# EAGLE design Meishino_v12 (EAGLE 9.0.1)
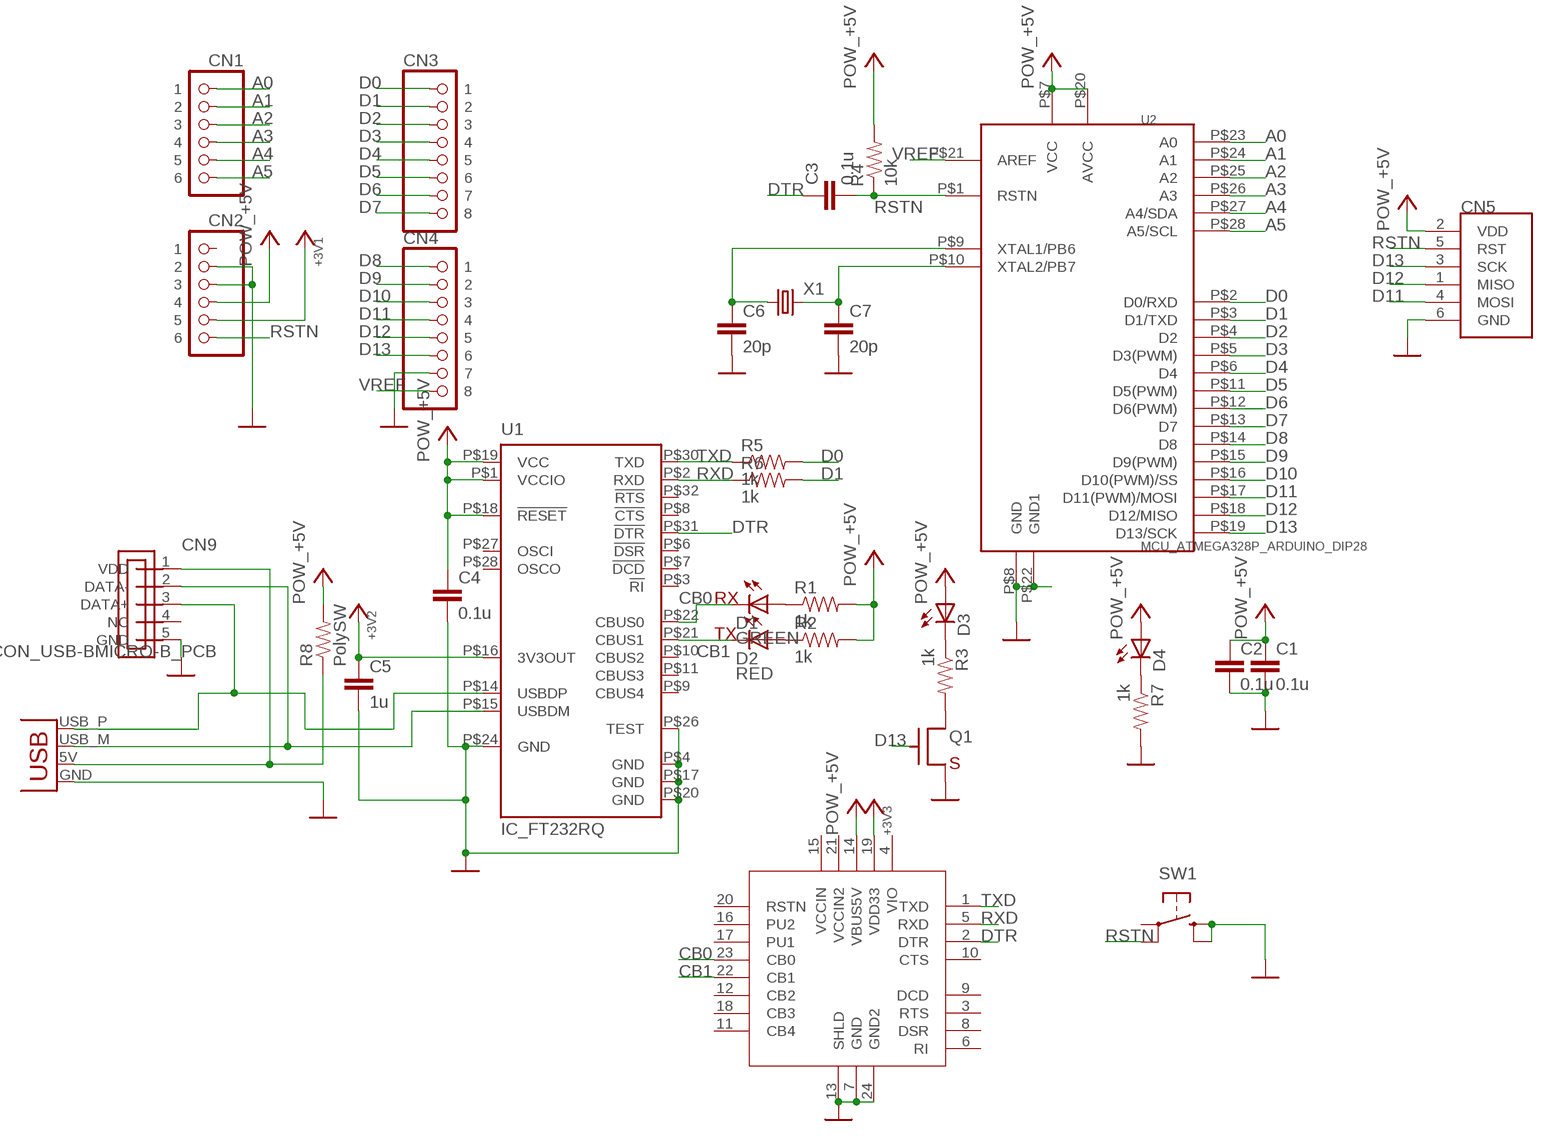
[diagram p0: schematic, sheet 1]

## Parts
C1  0.1u  CAPTH_5MML  [CAP_TH_5MM_L]
C2  0.1u  CAPTH_5MML  [CAP_TH_5MM_L]
C3  0.1u  CAPTH_5MML  [CAP_TH_5MM_L]
C4  0.1u  CAPTH_5MML  [CAP_TH_5MM_L]
C5  1u  CAPTH_5MML  [CAP_TH_5MM_L]
C6  20p  CAPTH_5MML  [CAP_TH_5MM_L]
C7  20p  CAPTH_5MML  [CAP_TH_5MM_L]
CN1  CON_PINHD-1X6  [1X06]
CN2  CON_PINHD-1X6  [1X06]
CN3  CON_PINHD-1X8  [1X08]
CN4  CON_PINHD-1X8  [1X08]
CN5  CON_AVRISPTH  [2X03R]
CN9  CON_USB-BMICRO-B_PCB  [USB-MICRO-PCB]
D1  GREEN  LED5MM  [SPARKFUN_LED5MM]
D2  RED  LED5MM  [SPARKFUN_LED5MM]
D3  LED5MM  [SPARKFUN_LED5MM]
D4  LED5MM  [SPARKFUN_LED5MM]
JP2  CON_USBPCB  [USB-A-PCB]
Q1  TR_NMOS_2N7000  [TO-92]
R1  1k  RESTH_10MML  [R_TH_10MM_L]
R2  1k  RESTH_10MML  [R_TH_10MM_L]
R3  1k  RESTH_10MML  [R_TH_10MM_L]
R4  10k  RESTH_10MML  [R_TH_10MM_L]
R5  1k  RESTH_10MML  [R_TH_10MM_L]
R6  1k  RESTH_10MML  [R_TH_10MM_L]
R7  1k  RESTH_10MML  [R_TH_10MM_L]
R8  PolySW  RESTH_10MML  [R_TH_10MM_L]
SW1  SW_TACTTH  [SW_B3F-10XX]
U1  IC_FT232RQ  [QFN32]
U2  MCU_ATMEGA328P_ARDUINO_DIP28  [DIP-28P(300MIL)]
U3  MOD_AE_FT232_DIP24  [DIP24_600MIL]
X1  XTAL2HC49US  [HC49US]

## Nets
+3V3: C5.1 CN2.5 U1.P$16(3V3OUT) U3.19(VDD33) ; supply symbol labelled POW_+3V3
+5V: C1.1 C2.1 C4.1 CN2.4 CN5.2(VDD) D3.A D4.A R1.2 R2.2 R4.2 R8.2 U1.P$1(VCCIO) U1.P$18(!RESET) U1.P$19(VCC) U2.P$7(VCC) U2.P$20(AVCC) U3.14(VBUS5V) ; supply symbol labelled POW_+5V
A0: CN1.1 U2.P$23(A0)
A1: CN1.2 U2.P$24(A1)
A2: CN1.3 U2.P$25(A2)
A3: CN1.4 U2.P$26(A3)
A4: CN1.5 U2.P$27(A4/SDA)
A5: CN1.6 U2.P$28(A5/SCL)
CB0: D1.K(C) U1.P$22(CBUS0) U3.23(CB0)
CB1: D2.K(C) U1.P$21(CBUS1) U3.22(CB1)
D0: CN3.1 R5.2 U2.P$2(D0/RXD)
D1: CN3.2 R6.2 U2.P$3(D1/TXD)
D2: CN3.3 U2.P$4(D2)
D3: CN3.4 U2.P$5(D3(PWM))
D4: CN3.5 U2.P$6(D4)
D5: CN3.6 U2.P$11(D5(PWM))
D6: CN3.7 U2.P$12(D6(PWM))
D7: CN3.8 U2.P$13(D7)
D8: CN4.1 U2.P$14(D8)
D9: CN4.2 U2.P$15(D9(PWM))
D10: CN4.3 U2.P$16(D10(PWM)/SS)
D11: CN4.4 CN5.4(MOSI) U2.P$17(D11(PWM)/MOSI)
D12: CN4.5 CN5.1(MISO) U2.P$18(D12/MISO)
D13: CN4.6 CN5.3(SCK) Q1.2(G) U2.P$19(D13/SCK)
DTR: C3.1 U1.P$31(!DTR) U3.2(DTR)
GND: C1.2 C2.2 C4.2 C5.2 C6.2 C7.2 CN2.2 CN2.3 CN4.7 CN5.6(GND) CN9.5(GND) JP2.GND Q1.1(S) R7.2 SW1.1(S) SW1.2(S1) U1.P$4(GND) U1.P$17(GND) U1.P$20(GND) U1.P$24(GND) U1.P$26(TEST) U2.P$8(GND) U2.P$22(GND1) U3.7(GND) U3.13(SHLD) U3.24(GND2) ; supply symbol labelled POW_GND
N$1: D1.A R1.1
N$2: D2.A R2.1
N$7: D3.K(C) R3.1
N$9: CN9.3(DATA+) JP2.USB_P(D+) U1.P$14(USBDP)
N$12: CN9.2(DATA-) JP2.USB_M(D-) U1.P$15(USBDM)
N$14: D4.K(C) R7.1
N$15: C6.1 U2.P$9(XTAL1/PB6) X1.1
N$16: C7.1 U2.P$10(XTAL2/PB7) X1.2
N$18: CN9.1(VDD) JP2.5V(VBUS) R8.1
N$19: Q1.3(D) R3.2
RSTN: C3.2 CN2.6 CN5.5(RST) R4.1 SW1.4(P1) U2.P$1(RSTN)
RXD: R6.1 U1.P$2(RXD) U3.5(RXD)
TXD: R5.1 U1.P$30(TXD) U3.1(TXD)
VREF: CN4.8 U2.P$21(AREF)
Unconnected: CN2.1 CN9.4(NC) SW1.3(P) U1.P$3(!RI) U1.P$6(!DSR) U1.P$7(!DCD) U1.P$8(!CTS) U1.P$9(CBUS4) U1.P$10(CBUS2) U1.P$11(CBUS3) U1.P$27(OSCI) U1.P$28(OSCO) U1.P$32(!RTS) U3.3(RTS) U3.4(VIO) U3.6(RI) U3.8(DSR) U3.9(DCD) U3.10(CTS) U3.11(CB4) U3.12(CB2) U3.15(VCCIN) U3.16(PU2) U3.17(PU1) U3.18(CB3) U3.20(RSTN) U3.21(VCCIN2)

## Notes on the sheet
- RX
- TX

## Library data of the parts
C1-C7 = akita:CAP: Capacitor Standard 0603 ceramic capacitor, and 0.1" leaded capacitor.
CN1 CN2 = akita:CON_PINHD-1X6: PIN HEADER
CN3 CN4 = akita:CON_PINHD-1X8: PIN HEADER
CN5 = akita:CON_AVRISP: AVR ISP standard 2x3 connector
CN9 = akita:CON_USB-B
D1-D4 = akita:LED: LEDs Standard schematic elements and footprints for 5mm, 3mm, 1206, and 0603 sized LEDs. 5mm - Spark Fun Electronics SKU : COM-00529 (and others)
JP2 = akita:CON_USB: USB Connectors USB-B-PTH is fully proven SKU : PRT-00139/CONN-08278 USB-miniB is fully proven SKU : PRT-00587 USB-A-PCB is untested. USB-A-H is throughly reviewed, but untested. Spark Fun Electronics SKU : PRT-00437 USB-B-SMT is throughly reviewed, but untested. Needs silkscreen touching up. USB-A-S has not been used/tested USB-MB-H has not been used/tested USB-MICROB has been used. CONN-09505
Q1 = akita:TR_NMOS_2N7000: 2N7000, nMOS
R1-R8 = akita:RES: Resistor Basic schematic elements and footprints for 0603, 1206, and PTH resistors.
SW1 = akita:SW_TACT: OMRON SWITCH; MPN: B3F-1000; OC_FARNELL: 176432; OC_NEWARK: 36M3542
U1 = akita:IC_FT232R: Source: http://www.ftdichip.com/Documents/DataSheets/DS_FT232R_v104.pdf
U2 = akita:MCU_ATMEGA328P_ARDUINO_DIP28: ATmega328P, Arduino's pin assign, DIP28
U3 = akita:MOD_AE_FT232_DIP24: Akizuki's FT232, DIP24
X1 = akita:XTAL2: Crystals Various standard crystals. Proven footprints. Spark Fun Electronics SKU : COM-00534

## Board
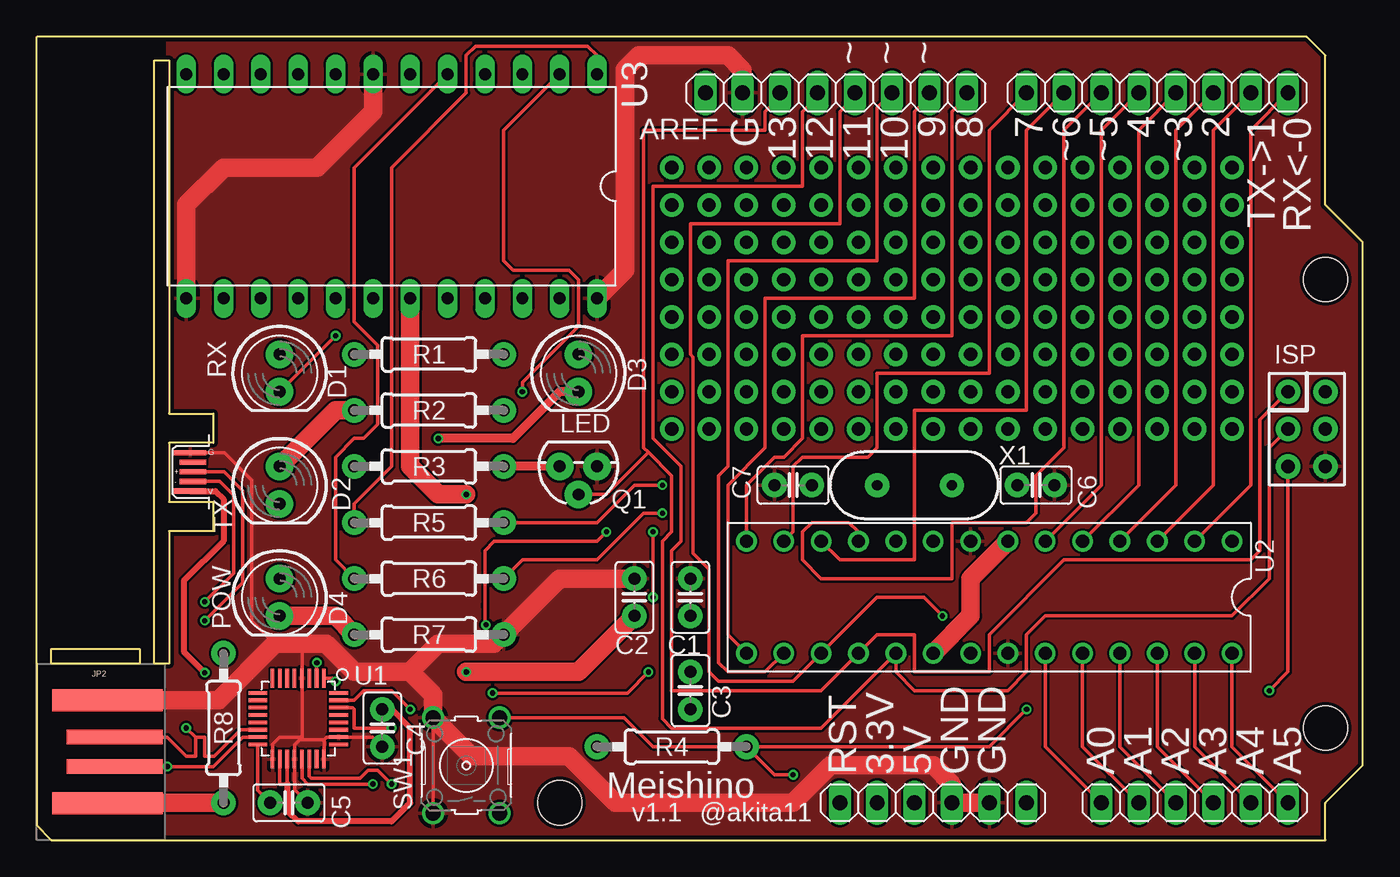
[diagram p1: board, top side]
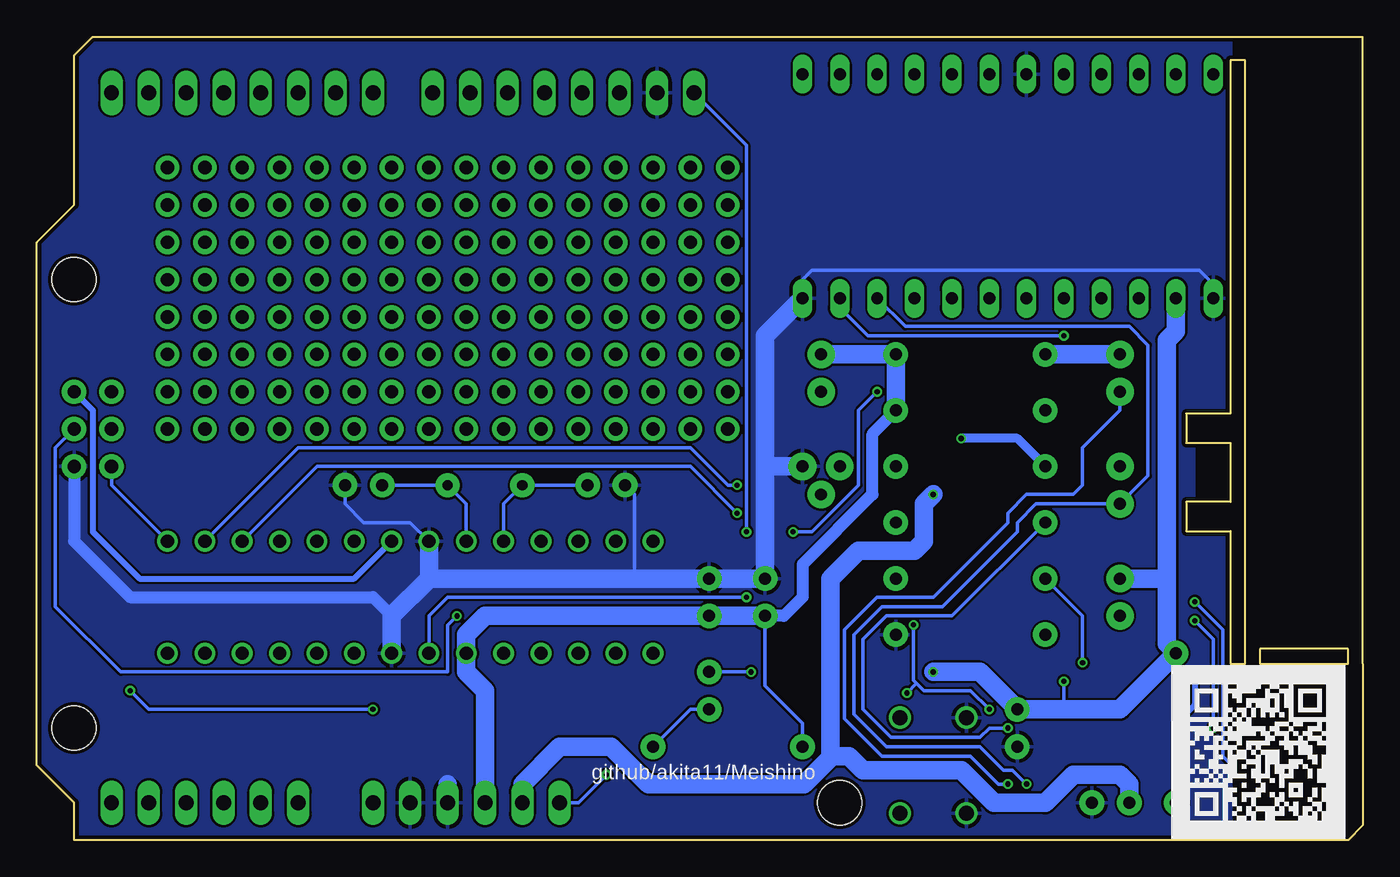
[diagram p2: board, bottom side, seen from below]

Size 90.17 x 54.61 mm. Coordinates in mm from the lower left corner, seen from the top.
Outline: 1,0 87.63,0 87.63,2.54 90.17,5.08 90.17,40.64 87.63,43.18 87.63,53.34 86.36,54.61 0,54.61 0,12 0,1 1,0
Outline: 9,29 12,29 12,27 9,27 9,23 12,23 12,21 9,21 9,12 8,12 8,53 9,53 9,29
Outline: 7,12 1,12 1,13 7,13 7,12
Copper layers (1*16): Top 0.035mm / dielectric 1.5mm / Bottom 0.035mm
Design rules "SeeedStudio_2layer_DRU_no_angle_20140221": minimum track width 6mil, minimum drill 12mil, track to track 6mil, track to pad 6mil, pad to pad 6mil, via to via 6mil, smd to smd 0mil, copper to edge 10mil, drill to drill 10mil, minimum pad ring 10mil, minimum via ring 6mil, stop-mask expansion 2mil, vias tented up to drill 100mil, thermal gap 10mil
Holes 3 mm at 87.63,7.62 87.63,38.1 35.56,2.54

### Footprints (pad centres in the part's own frame; a part is rotated, then mirrored left to right if it is on the bottom)
CAP_TH_5MM_L = drill 0.813 pad 1.676: 1 -1.27,0; 2 1.27,0
1X06 = drill 1.016 long: 1 -6.35,0; 2 -3.81,0; 3 -1.27,0; 4 1.27,0; 5 3.81,0; 6 6.35,0
1X08 = drill 1.016 long: 1 -8.89,0; 2 -6.35,0; 3 -3.81,0; 4 -1.27,0; 5 1.27,0; 6 3.81,0; 7 6.35,0; 8 8.89,0
2X03R = drill 0.9 pad 1.651: 1 -2.54,-1.27; 2 -2.54,1.27; 3 0,-1.27; 4 0,1.27; 5 2.54,-1.27; 6 2.54,1.27
USB-MICRO-PCB = smd 0.35 x 2.2: 1 1.3,-1.3; 5 -1.3,-1.3 | smd 0.35 x 1.8: 2 0.65,-1.1; 3 0,-1.1; 4 -0.65,-1.1
SPARKFUN_LED5MM = drill 0.813 pad 1.88: A -1.27,0; K 1.27,0
USB-A-PCB = smd 7.5 x 1.5: 5V -0.2,-3.5; GND -0.2,3.5 | smd 6.5 x 1: USB_M 0.3,-1; USB_P 0.3,1
TO-92 = drill 0.813 pad 1.88: 1 -1.27,0; 2 0,1.905; 3 1.27,0
R_TH_10MM_L = drill 0.813 pad 1.676: 1 -5.08,0; 2 5.08,0
SW_B3F-10XX = drill 1.016: 1 -3.251,2.261; 2 3.251,2.261; 3 -3.251,-2.261; 4 3.251,-2.261
QFN32 = smd 1.27 x 0.25: P$1 -2.75,1.75; P$2 -2.75,1.25; P$3 -2.75,0.75; P$4 -2.75,0.25; P$5 -2.75,-0.25; P$6 -2.75,-0.75; P$7 -2.75,-1.25; P$8 -2.75,-1.75; P$17 2.75,-1.75; P$18 2.75,-1.25; P$19 2.75,-0.75; P$20 2.75,-0.25; P$21 2.75,0.25; P$22 2.75,0.75; P$23 2.75,1.25; P$24 2.75,1.75 | smd 0.25 x 1.27: P$9 -1.75,-2.75; P$10 -1.25,-2.75; P$11 -0.75,-2.75; P$12 -0.25,-2.75; P$13 0.25,-2.75; P$14 0.75,-2.75; P$15 1.25,-2.75; P$16 1.75,-2.75; P$25 1.75,2.75; P$26 1.25,2.75; P$27 0.75,2.75; P$28 0.25,2.75; P$29 -0.25,2.75; P$30 -0.75,2.75; P$31 -1.25,2.75; P$32 -1.75,2.75
DIP-28P(300MIL) = drill 0.9: P$1 -17.78,-3.81; P$2 -15.24,-3.81; P$3 -12.7,-3.81; P$4 -10.16,-3.81; P$5 -7.62,-3.81; P$6 -5.08,-3.81; P$7 -2.54,-3.81; P$8 0,-3.81; P$9 2.54,-3.81; P$10 5.08,-3.81; P$11 7.62,-3.81; P$12 10.16,-3.81; P$13 12.7,-3.81; P$14 15.24,-3.81; P$15 15.24,3.81; P$16 12.7,3.81; P$17 10.16,3.81; P$18 7.62,3.81; P$19 5.08,3.81; P$20 2.54,3.81; P$21 0,3.81; P$22 -2.54,3.81; P$23 -5.08,3.81; P$24 -7.62,3.81; P$25 -10.16,3.81; P$26 -12.7,3.81; P$27 -15.24,3.81; P$28 -17.78,3.81
DIP24_600MIL = drill 0.813 long: 1 -13.97,-7.62; 2 -11.43,-7.62; 3 -8.89,-7.62; 4 -6.35,-7.62; 5 -3.81,-7.62; 6 -1.27,-7.62; 7 1.27,-7.62; 8 3.81,-7.62; 9 6.35,-7.62; 10 8.89,-7.62; 11 11.43,-7.62; 12 13.97,-7.62; 13 13.97,7.62; 14 11.43,7.62; 15 8.89,7.62; 16 6.35,7.62; 17 3.81,7.62; 18 1.27,7.62; 19 -1.27,7.62; 20 -3.81,7.62; 21 -6.35,7.62; 22 -8.89,7.62; 23 -11.43,7.62; 24 -13.97,7.62
HC49US = drill 0.7 pad 1.651: 1 -2.54,0; 2 2.54,0

### Placement (x,y rotation side)
C1  44.45,16.51 90 top
C2  40.64,16.51 90 top
C3  44.45,10.16 270 top
C4  23.5,7.62 270 top
C5  17.14,2.54 0 top
C6  67.94,24.13 0 top
C7  51.44,24.13 180 top
CN1  78.74,2.54 0 top
CN2  60.96,2.54 180 top
CN3  76.2,50.8 180 top
CN4  54.36,50.8 180 top
CN5  86.36,27.94 270 top
CN9  11.72,25.03 270 top
D1  16.51,31.75 270 top
D2  16.51,24.13 270 top
D3  36.83,31.75 270 top
D4  16.51,16.51 270 top
JP2  5,6 0 top
Q1  36.83,25.4 180 top
R1  26.67,33.02 0 top
R2  26.67,29.21 0 top
R3  26.67,25.4 0 top
R4  43.18,6.35 180 top
R5  26.67,21.59 0 top
R6  26.67,17.78 0 top
R7  26.67,13.97 0 top
R8  12.7,7.62 90 top
SW1  29.21,5.08 90 top
U1  17.78,8.26 270 top
U2  63.5,16.51 180 top
U3  24.13,44.45 180 top
X1  59.69,24.13 180 top

### Tracks (layer width: path | path; a pad name or v marks a point on that pad's centre or on a via)
+3V3  (via drill 0.35)
  Top 0.254: U1.P$16 15.03,3.38 C5.1
  Top 1.27: U3.19 25.4,25.4 27.3,23.5 v29.21,23.5
  Bottom 1.27: C5.1 15.88,3.81 16.51,4.45 19.68,4.45 21.59,2.54 25.08,2.54 27.3,4.76 33.97,4.76 34.92,5.71 36.2,5.71 | CN2.5 57.15,3.81 54.61,6.35 51.12,6.35 48.58,3.81 37.99,3.81 36.2,5.6 36.2,5.71 | v29.21,23.5 29.84,22.86 29.84,20.32 30.48,19.68 34.29,19.68 36.2,17.78 36.2,5.71
+5V  (via drill 0.35)
  Top 0.254: U1.P$19 17.03,3.81 16.53,3.81 U1.P$18 | 23.5,9.53 C4.1 | U1.P$1 20.11,11.01 v20.32,10.79
  Top 0.406: C4.1 24.13,8.89 25.4,7.62 25.4,2.54 24.13,1.27 17.78,1.27 17.14,1.91 17.14,3.13 17.05,3.23 17.05,3.79 17.03,3.81
  Top 1.27: U2.P$7 63.5,17.78 63.5,15.24 U2.P$20 | C2.1 36.83,11.43 v29.21,11.43
  Bottom 0.254: v20.32,10.79 20.32,8.89 | R4.2 38.1,7.94 40.64,10.48 C2.1
  Bottom 0.406: 87.63,30.25 CN5.2 86.36,29.21 86.36,20.95 83.19,17.78 68.58,17.78 U2.P$7
  Bottom 0.813: C2.1 39.37,15.24 38.1,16.51 38.1,18.73 33.34,23.5 33.34,27.62 R2.2
  Bottom 1.27: CN2.4 59.69,10.16 60.96,11.43 U2.P$20 60.96,13.97 59.69,15.24 C1.1 C2.1 | v29.21,11.43 26.04,11.43 C4.1 20.32,8.89 16.51,8.89 R8.2 13.34,13.34 13.34,17.78 | D3.A R1.2 R2.2 | U3.14 12.7,34.61 13.34,33.97 13.34,17.78 | D4.A 13.34,17.78
A0
  Top 0.254: U2.P$23 68.58,6.35 CN1.1
A1
  Top 0.254: U2.P$24 71.12,6.35 CN1.2
A2
  Top 0.254: U2.P$25 73.66,6.35 CN1.3
A3
  Top 0.254: U2.P$26 76.2,6.35 CN1.4
A4
  Top 0.254: U2.P$27 78.74,6.35 CN1.5
A5
  Top 0.254: U2.P$28 81.28,6.35 CN1.6
CB0  (via drill 0.35)
  Top 0.254: U1.P$22 18.53,4.33 18.64,4.22 22,4.22 22.54,4.76 23.18,4.76 v24.13,3.81 | D1.K v20.32,34.29
  Bottom 0.254: D1.K 16.51,29.21 19.05,26.67 19.05,24.13 19.68,23.5 22.86,23.5 24.13,22.23 24.13,21.59 29.21,16.51 33.02,16.51 35.24,14.29 35.24,8.26 32.7,5.71 26.67,5.71 24.77,3.81 v24.13,3.81 | v20.32,34.29 33.66,34.29 35.56,36.2 U3.23
CB1  (via drill 0.35)
  Top 0.254: U1.P$21 18.03,4.2 18.41,3.81 v22.86,3.81
  Bottom 0.254: v22.86,3.81 23.81,4.76 24.45,4.76 26.04,6.35 32.38,6.35 34.61,8.57 34.61,13.97 32.7,15.88 28.57,15.88 23.5,20.95 23.5,21.59 22.23,22.86 D2.K 14.61,24.77 14.61,33.66 15.88,34.92 31.11,34.92 U3.22
D0  (via drill 0.35)
  Top 0.254: U2.P$2 82.55,24.13 82.55,48.26 CN3.1 | v42.55,24.13 40.64,24.13 38.1,21.59 R5.2
  Bottom 0.254: U2.P$2 72.39,26.67 45.72,26.67 43.18,24.13 v42.55,24.13
D1  (via drill 0.35)
  Top 0.254: U2.P$3 80.01,24.13 80.01,48.26 CN3.2 | R6.2 33.02,19.05 38.1,19.05 39.37,20.32 40.03,20.98 41.27,22.23 v42.55,22.23
  Bottom 0.254: U2.P$3 71.12,25.4 45.72,25.4 v42.55,22.23
D2
  Top 0.254: U2.P$4 77.47,24.13 77.47,48.26 CN3.3
D3
  Top 0.254: U2.P$5 74.93,24.13 74.93,48.26 CN3.4
D4
  Top 0.254: U2.P$6 72.39,24.13 72.39,48.26 CN3.5
D5
  Top 0.254: CN3.6 69.85,48.26 69.85,26.67 67.94,24.77 67.94,22.23 67.31,21.59 62.23,21.59 62.23,17.78 53.34,17.78 52.07,19.05 52.07,20.95 52.7,21.59 55.24,21.59 55.88,20.95 U2.P$11
D6
  Top 0.254: CN3.7 67.31,48.26 67.31,29.21 59.69,29.21 59.69,19.05 54.61,19.05 U2.P$12
D7
  Top 0.254: CN3.8 64.77,48.26 64.77,31.75 57.15,31.75 57.15,26.67 56.52,26.04 52.07,26.04 51.44,25.4 51.44,20.95 U2.P$13
D8
  Top 0.254: CN4.1 63.25,50.55 62.23,49.53 62.23,34.29 52.07,34.29 52.07,27.3 50.8,26.04 50.16,26.04 48.26,24.13 U2.P$14
D9
  Top 0.254: CN4.2 60.71,50.55 59.69,49.53 59.69,36.83 49.53,36.83 49.53,26.67 46.99,24.13 46.99,13.97 U2.P$15
D10
  Top 0.254: CN4.3 57.15,49.78 57.15,39.37 46.99,39.37 46.99,25.4 46.35,24.77 46.35,12.06 46.99,11.43 49.53,11.43 U2.P$16
D11  (via drill 0.35)
  Top 0.254: CN4.4 55.63,50.55 54.61,49.53 54.61,41.91 44.45,41.91 44.45,33.02 44.64,32.83 44.64,19.49 45.72,18.41 45.72,11.43 46.35,10.79 51.44,10.79 U2.P$17 57.15,16.51 60.33,16.51 v61.59,15.24
  Bottom 0.254: v61.59,15.24 62.23,14.61 62.23,11.43 84.45,11.43 88.9,15.88 88.9,26.67 CN5.4
D12
  Top 0.254: CN4.5 53.09,50.55 52.07,49.53 52.07,44.45 41.91,44.45 41.91,27.3 43.81,25.4 43.81,20.32 43.18,19.68 43.18,10.16 53.34,10.16 U2.P$18 57.15,13.97 59.69,13.97 59.69,11.43 64.77,11.43 64.77,13.97 69.85,19.05 82.55,19.05 83.19,19.68 83.19,28.57 CN5.1
D13
  Top 0.254: CN4.6 50.55,50.55 49.53,49.53 49.53,48.26 41.27,48.26 41.27,26.67 41.59,26.35 | 41.59,26.35 43.18,24.77 43.18,20.95 42.55,20.32 42.55,8.26 43.18,7.62 53.34,7.62 U2.P$19 58.42,11.43 59.69,10.16 66.04,10.16 67.31,11.43 67.31,13.97 68.58,15.24 81.28,15.24 83.82,17.78 83.82,26.67 CN5.3 | Q1.2 38.73,23.5 41.59,26.35
DTR  (via drill 0.35)
  Top 0.254: U1.P$31 21.57,9.51 22.23,10.16 24.13,10.16 v25.4,8.89 | 30.48,16 30.48,19.68 31.11,20.32 38.1,20.32 v38.73,20.95 | 30.48,16 30.48,15.88 | 30.48,16 30.48,14.61 30.52,14.61 v30.55,14.63 | v41.59,11.43 40.16,10 v31,10 | U3.2 31.75,48.26 31.75,39.37 32.38,38.73 36.2,38.73 36.83,38.1 36.83,34.92 33.02,31.11 v33.02,30.48
  Bottom 0.254: v25.4,8.89 26.67,10.16 29.84,10.16 30.34,10.66 | v33.02,30.48 34.29,29.21 34.29,24.13 37.47,20.95 v38.73,20.95 | v30.55,14.63 30.55,10.86 30.34,10.66 | v31,10 30.34,10.66 | C3.1 v41.59,11.43
GND
  Top 0.254: U1.P$20 17.53,3.42 C5.2 | 16.03,5.87 U1.P$17 16.03,6.5 16.51,6.99 18.03,6.99 | U1.P$20 17.53,5.96 | U1.P$26 20.34,7 | U1.P$24 19.53,6.83 | 18.03,6.99 U1.P$4 18.03,13.09 17.78,13.34 | 18.03,6.99 18.03,6.83 19.53,6.83 | U1.P$26 22.84,7 C4.2 | 18.03,6.99 17.53,6.49 U1.P$20 | U1.P$26 19.7,7 19.53,6.83 | 16.19,13.34 14.62,14.9 14.62,24.48 12.77,26.33 CN9.5 | SW1.1 SW1.2
  Top 1.27: JP2.GND 4.83,9.53 12.38,9.53 16.19,13.34 17.78,13.34 19.68,13.34 21.59,11.43 25.4,11.43 | CN2.2 CN2.3 62.23,3.81 60.96,5.08 53.98,5.08 51.44,2.54 39.37,2.54 36.2,5.71 29.57,5.71 SW1.2 26.95,9.88 25.4,11.43 | C2.2 35.56,17.78 R7.2 31.11,13.34 27.3,13.34 25.4,11.43 | CN4.7 48.01,52.32 46.99,53.34 40.96,53.34 40.01,52.39 40.01,38.73 U3.24 | U3.7 22.86,49.53 19.05,45.72 12.7,45.72 10.16,43.18 U3.13
  Bottom 0.254: C6.2 69.22,22.86 67.94,21.59 64.77,21.59 U2.P$8 | C7.2 49.53,23.5 49.53,17.78 | U3.24 38.1,38.1 37.47,38.73 11.11,38.73 10.16,37.78 U3.13
  Bottom 0.813: 66.04,15.24 67.31,16.51 83.82,16.51 87.63,20.32 CN5.6
  Bottom 1.27: 62.23,3.81 CN2.3 | 63.5,17.78 49.53,17.78 C1.2 C2.2 40.64,25.4 | U3.24 40.64,34.29 40.64,25.4 | Q1.1 40.64,25.4 | U2.P$22 66.04,15.24 63.5,17.78 | U2.P$8 63.5,17.78
  pour Top: 8.89,54.61 86.36,54.61 87.63,53.34 87.63,43.18 90.17,40.64 90.17,5.08 87.63,2.54 87.63,0 8.89,0
  pour Bottom: 8.89,54.61 86.36,54.61 87.63,53.34 87.63,43.18 90.17,40.64 90.17,5.08 87.63,2.54 87.63,0 8.89,0
N$1
  Bottom 1.27: D1.A R1.1
N$2
  Top 1.27: R2.1 20.32,29.21 D2.A
N$3  (via drill 0.9 pad 1.6)
  other vias: 43.18,27.94
N$4  (via drill 0.9 pad 1.6)
  other vias: 45.72,27.94
N$7  (via drill 0.35)
  Top 0.61: D3.K 35.56,30.48 32.38,27.3 v27.3,27.3
  Bottom 0.61: R3.1 23.5,27.3 v27.3,27.3
N$8  (via drill 0.9 pad 1.6)
  other vias: 48.26,27.94
N$9  (via drill 0.35)
  Top 0.254: U1.P$14 13.86,7.5 12.06,5.71 11.43,5.71 11.43,6.99 10.79,6.99 | 10.79,6.99 10.79,5.71 10.16,5.71 8.88,7 JP2.USB_P | v11.43,14.92 14.02,17.51 14.02,23.77 12.75,25.03 CN9.3 | v10.16,7.62 10.79,6.99
  Bottom 0.254: v11.43,14.92 10.16,13.65 v10.16,7.62
N$10  (via drill 0.9 pad 1.6)
  other vias: 50.8,27.94
N$11  (via drill 0.9 pad 1.6)
  other vias: 53.34,27.94
N$12  (via drill 0.35)
  Top 0.254: U1.P$15 13.99,7 11.98,5 v8.89,5 JP2.USB_M | v11.43,16.19 13.38,18.14 13.38,23.45 12.45,24.38 CN9.2
  Bottom 0.254: v11.43,16.19 9.53,14.29 9.53,5.71 8.89,5.08 v8.89,5
N$13  (via drill 0.9 pad 1.6)
  other vias: 55.88,27.94
N$14
  Top 1.27: D4.K 20.32,15.24 R7.1
N$15
  Bottom 0.254: U2.P$9 60.96,22.86 X1.1 C6.1
N$16
  Bottom 0.254: U2.P$10 58.42,22.86 X1.2 C7.1
N$17  (via drill 0.9 pad 1.6)
  other vias: 58.42,27.94
N$18  (via drill 0.35)
  Top 0.406: v11.43,11.38 10,12.81 10,17.62 12.7,20.32 12.7,23.18 12.15,23.73 CN9.1
  Top 1.27: JP2.5V 4.84,2.54 R8.1
  Bottom 0.406: v11.43,11.38 11.43,9.21 12.7,7.94 R8.1
N$19
  Top 0.61: Q1.3 R3.2
N$20  (via drill 0.9 pad 1.6)
  other vias: 60.96,27.94
N$21  (via drill 0.9 pad 1.6)
  other vias: 63.5,27.94
N$22  (via drill 0.9 pad 1.6)
  other vias: 66.04,27.94
N$23  (via drill 0.9 pad 1.6)
  other vias: 68.58,27.94
N$24  (via drill 0.9 pad 1.6)
  other vias: 71.12,27.94
N$25  (via drill 0.9 pad 1.6)
  other vias: 73.66,27.94
N$26  (via drill 0.9 pad 1.6)
  other vias: 76.2,27.94
N$27  (via drill 0.9 pad 1.6)
  other vias: 78.74,27.94
N$28  (via drill 0.9 pad 1.6)
  other vias: 81.28,27.94
N$29  (via drill 0.9 pad 1.6)
  other vias: 43.18,30.48
N$30  (via drill 0.9 pad 1.6)
  other vias: 45.72,30.48
N$31  (via drill 0.9 pad 1.6)
  other vias: 48.26,30.48
N$32  (via drill 0.9 pad 1.6)
  other vias: 50.8,30.48
N$33  (via drill 0.9 pad 1.6)
  other vias: 53.34,30.48
N$34  (via drill 0.9 pad 1.6)
  other vias: 55.88,30.48
N$35  (via drill 0.9 pad 1.6)
  other vias: 58.42,30.48
N$36  (via drill 0.9 pad 1.6)
  other vias: 60.96,30.48
N$37  (via drill 0.9 pad 1.6)
  other vias: 63.5,30.48
N$38  (via drill 0.9 pad 1.6)
  other vias: 66.04,30.48
N$39  (via drill 0.9 pad 1.6)
  other vias: 68.58,30.48
N$40  (via drill 0.9 pad 1.6)
  other vias: 71.12,30.48
N$41  (via drill 0.9 pad 1.6)
  other vias: 73.66,30.48
N$42  (via drill 0.9 pad 1.6)
  other vias: 76.2,30.48
N$43  (via drill 0.9 pad 1.6)
  other vias: 78.74,30.48
N$44  (via drill 0.9 pad 1.6)
  other vias: 81.28,30.48
N$45  (via drill 0.9 pad 1.6)
  other vias: 43.18,33.02
N$46  (via drill 0.9 pad 1.6)
  other vias: 45.72,33.02
N$47  (via drill 0.9 pad 1.6)
  other vias: 48.26,33.02
N$48  (via drill 0.9 pad 1.6)
  other vias: 50.8,33.02
N$49  (via drill 0.9 pad 1.6)
  other vias: 53.34,33.02
N$50  (via drill 0.9 pad 1.6)
  other vias: 55.88,33.02
N$51  (via drill 0.9 pad 1.6)
  other vias: 58.42,33.02
N$52  (via drill 0.9 pad 1.6)
  other vias: 60.96,33.02
N$53  (via drill 0.9 pad 1.6)
  other vias: 63.5,33.02
N$54  (via drill 0.9 pad 1.6)
  other vias: 66.04,33.02
N$55  (via drill 0.9 pad 1.6)
  other vias: 68.58,33.02
N$56  (via drill 0.9 pad 1.6)
  other vias: 71.12,33.02
N$57  (via drill 0.9 pad 1.6)
  other vias: 73.66,33.02
N$58  (via drill 0.9 pad 1.6)
  other vias: 76.2,33.02
N$59  (via drill 0.9 pad 1.6)
  other vias: 78.74,33.02
N$60  (via drill 0.9 pad 1.6)
  other vias: 81.28,33.02
N$61  (via drill 0.9 pad 1.6)
  other vias: 43.18,35.56
N$62  (via drill 0.9 pad 1.6)
  other vias: 45.72,35.56
N$63  (via drill 0.9 pad 1.6)
  other vias: 48.26,35.56
N$64  (via drill 0.9 pad 1.6)
  other vias: 50.8,35.56
N$65  (via drill 0.9 pad 1.6)
  other vias: 53.34,35.56
N$66  (via drill 0.9 pad 1.6)
  other vias: 55.88,35.56
N$67  (via drill 0.9 pad 1.6)
  other vias: 58.42,35.56
N$68  (via drill 0.9 pad 1.6)
  other vias: 60.96,35.56
N$69  (via drill 0.9 pad 1.6)
  other vias: 63.5,35.56
N$70  (via drill 0.9 pad 1.6)
  other vias: 66.04,35.56
N$71  (via drill 0.9 pad 1.6)
  other vias: 68.58,35.56
N$72  (via drill 0.9 pad 1.6)
  other vias: 71.12,35.56
N$73  (via drill 0.9 pad 1.6)
  other vias: 73.66,35.56
N$74  (via drill 0.9 pad 1.6)
  other vias: 76.2,35.56
N$75  (via drill 0.9 pad 1.6)
  other vias: 78.74,35.56
N$76  (via drill 0.9 pad 1.6)
  other vias: 81.28,35.56
N$77  (via drill 0.9 pad 1.6)
  other vias: 43.18,38.1
N$78  (via drill 0.9 pad 1.6)
  other vias: 45.72,38.1
N$79  (via drill 0.9 pad 1.6)
  other vias: 48.26,38.1
N$80  (via drill 0.9 pad 1.6)
  other vias: 50.8,38.1
N$81  (via drill 0.9 pad 1.6)
  other vias: 53.34,38.1
N$82  (via drill 0.9 pad 1.6)
  other vias: 55.88,38.1
N$83  (via drill 0.9 pad 1.6)
  other vias: 58.42,38.1
N$84  (via drill 0.9 pad 1.6)
  other vias: 60.96,38.1
N$85  (via drill 0.9 pad 1.6)
  other vias: 63.5,38.1
N$86  (via drill 0.9 pad 1.6)
  other vias: 66.04,38.1
N$87  (via drill 0.9 pad 1.6)
  other vias: 68.58,38.1
N$88  (via drill 0.9 pad 1.6)
  other vias: 71.12,38.1
N$89  (via drill 0.9 pad 1.6)
  other vias: 73.66,38.1
N$90  (via drill 0.9 pad 1.6)
  other vias: 76.2,38.1
N$91  (via drill 0.9 pad 1.6)
  other vias: 78.74,38.1
N$92  (via drill 0.9 pad 1.6)
  other vias: 81.28,38.1
N$93  (via drill 0.9 pad 1.6)
  other vias: 43.18,40.64
N$94  (via drill 0.9 pad 1.6)
  other vias: 45.72,40.64
N$95  (via drill 0.9 pad 1.6)
  other vias: 48.26,40.64
N$96  (via drill 0.9 pad 1.6)
  other vias: 50.8,40.64
N$97  (via drill 0.9 pad 1.6)
  other vias: 53.34,40.64
N$98  (via drill 0.9 pad 1.6)
  other vias: 55.88,40.64
N$99  (via drill 0.9 pad 1.6)
  other vias: 58.42,40.64
N$100  (via drill 0.9 pad 1.6)
  other vias: 60.96,40.64
N$101  (via drill 0.9 pad 1.6)
  other vias: 63.5,40.64
N$102  (via drill 0.9 pad 1.6)
  other vias: 66.04,40.64
N$103  (via drill 0.9 pad 1.6)
  other vias: 68.58,40.64
N$104  (via drill 0.9 pad 1.6)
  other vias: 71.12,40.64
N$105  (via drill 0.9 pad 1.6)
  other vias: 73.66,40.64
N$106  (via drill 0.9 pad 1.6)
  other vias: 76.2,40.64
N$107  (via drill 0.9 pad 1.6)
  other vias: 78.74,40.64
N$108  (via drill 0.9 pad 1.6)
  other vias: 81.28,40.64
N$109  (via drill 0.9 pad 1.6)
  other vias: 43.18,43.18
N$110  (via drill 0.9 pad 1.6)
  other vias: 45.72,43.18
N$111  (via drill 0.9 pad 1.6)
  other vias: 48.26,43.18
N$112  (via drill 0.9 pad 1.6)
  other vias: 50.8,43.18
N$113  (via drill 0.9 pad 1.6)
  other vias: 53.34,43.18
N$114  (via drill 0.9 pad 1.6)
  other vias: 55.88,43.18
N$115  (via drill 0.9 pad 1.6)
  other vias: 58.42,43.18
N$116  (via drill 0.9 pad 1.6)
  other vias: 60.96,43.18
N$117  (via drill 0.9 pad 1.6)
  other vias: 63.5,43.18
N$118  (via drill 0.9 pad 1.6)
  other vias: 66.04,43.18
N$119  (via drill 0.9 pad 1.6)
  other vias: 68.58,43.18
N$120  (via drill 0.9 pad 1.6)
  other vias: 71.12,43.18
N$121  (via drill 0.9 pad 1.6)
  other vias: 73.66,43.18
N$122  (via drill 0.9 pad 1.6)
  other vias: 76.2,43.18
N$123  (via drill 0.9 pad 1.6)
  other vias: 78.74,43.18
N$124  (via drill 0.9 pad 1.6)
  other vias: 81.28,43.18
N$125  (via drill 0.9 pad 1.6)
  other vias: 43.18,45.72
N$126  (via drill 0.9 pad 1.6)
  other vias: 45.72,45.72
N$127  (via drill 0.9 pad 1.6)
  other vias: 48.26,45.72
N$128  (via drill 0.9 pad 1.6)
  other vias: 50.8,45.72
N$129  (via drill 0.9 pad 1.6)
  other vias: 53.34,45.72
N$130  (via drill 0.9 pad 1.6)
  other vias: 55.88,45.72
N$131  (via drill 0.9 pad 1.6)
  other vias: 58.42,45.72
N$132  (via drill 0.9 pad 1.6)
  other vias: 60.96,45.72
N$133  (via drill 0.9 pad 1.6)
  other vias: 63.5,45.72
N$134  (via drill 0.9 pad 1.6)
  other vias: 66.04,45.72
N$135  (via drill 0.9 pad 1.6)
  other vias: 68.58,45.72
N$136  (via drill 0.9 pad 1.6)
  other vias: 71.12,45.72
N$137  (via drill 0.9 pad 1.6)
  other vias: 73.66,45.72
N$138  (via drill 0.9 pad 1.6)
  other vias: 76.2,45.72
N$139  (via drill 0.9 pad 1.6)
  other vias: 78.74,45.72
N$140  (via drill 0.9 pad 1.6)
  other vias: 81.28,45.72
RSTN  (via drill 0.35)
  Top 0.254: v51.44,4.45 50.16,4.45 R4.1 | R4.1 64.77,6.35 v67.31,8.89 | CN5.5 85.09,11.43 v83.82,10.16 | SW1.4 39.93,8.33 41.91,6.35 R4.1
  Bottom 0.254: CN2.6 53.34,2.54 v51.44,4.45 | C3.2 45.72,8.89 R4.1 | v67.31,8.89 82.55,8.89 v83.82,10.16 | U2.P$1 85.09,24.13 CN5.5
RXD  (via drill 0.35)
  Top 0.254: U1.P$2 19.03,12.04 v19.05,12.06 | R6.1 20.32,19.05 20.32,26.04 21.59,27.3 22.23,27.3 23.18,28.26 23.18,33.66 21.59,35.24 21.59,45.72 25.4,49.53 U3.5
  Bottom 0.254: R6.1 19.05,15.24 v19.05,12.06
TXD  (via drill 0.35)
  Top 0.254: U1.P$30 21.48,9.01 21.59,8.89 21.59,7.62 v24.13,7.62 | R5.1 21.59,22.86 24.13,25.4 24.13,45.72 29.21,50.8 29.21,53.34 29.84,53.98 37.47,53.98 38.1,53.34 U3.1
  Bottom 0.254: R5.1 27.94,15.24 32.38,15.24 33.97,13.65 33.97,8.89 32.07,6.99 26.04,6.99 25.4,7.62 v24.13,7.62
VREF  (via drill 0.35)
  Top 0.254: v41.91,20.95 v41.91,16.51
  Bottom 0.254: U2.P$21 63.5,15.24 62.23,16.51 v41.91,16.51 | CN4.8 41.91,47.24 v41.91,20.95

### Text on the board
tPlace: ~ | ~ | ~ | AREF | G | 13 | 12 | 11 | 10 | 9 | 8 | 7 | ~6 | ~5 | 4 | ~3 | 2 | TX->1 | RX<-0 | ISP | RX | LED | TX | U2 | POW | U1 | RST | 3.3V | 5V | GND | GND | A0 | A1 | A2 | A3 | A4 | A5 | Meishino | v1.1 | @akita11
bPlace: github/akita11/Meishino